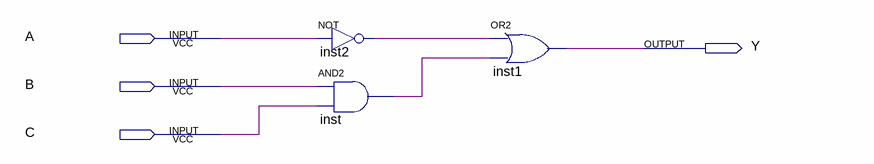
[diagram p0: schematic sheet]
// Quartus schematic LAB04_2.bdf as structural Verilog: 3 symbols, 4 pins
module LAB04_2 (
  input  A,
  input  B,
  input  C,
  output Y
);

  wire inst2_out, inst_out;

  not inst2 (inst2_out, A);
  and inst (inst_out, B, C);
  or inst1 (Y, inst2_out, inst_out);
endmodule
